# EAGLE schematic A-2 sch (EAGLE 9.6.2)
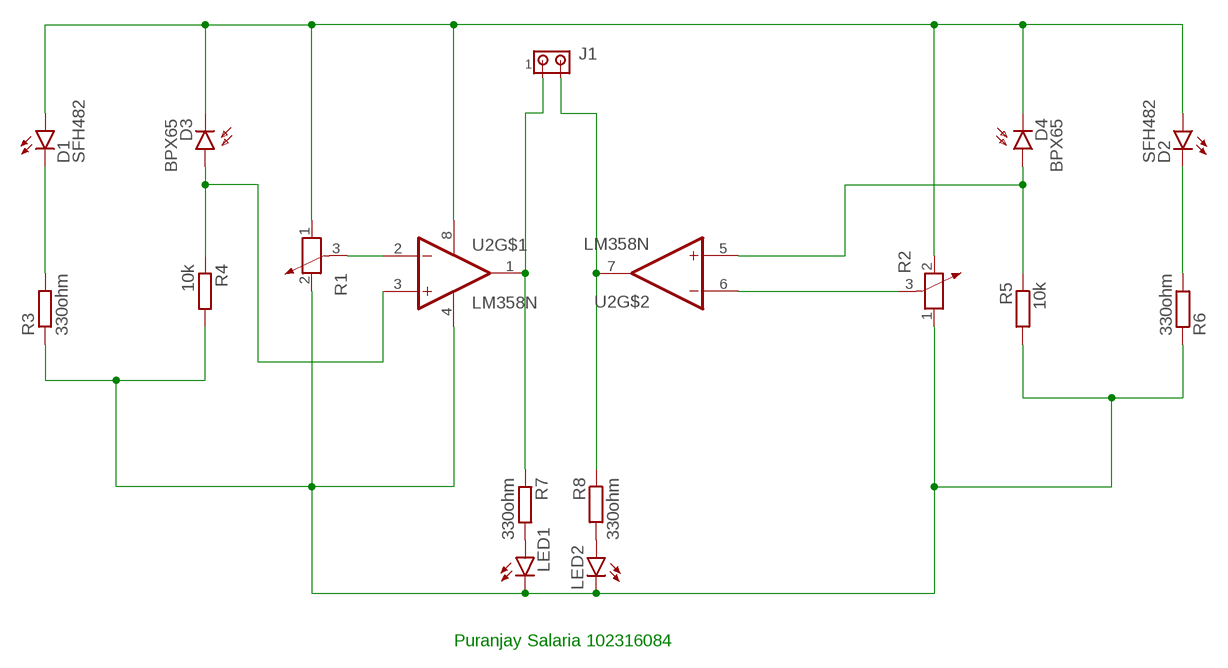
[diagram p0: schematic, sheet 1]

## Parts
D1  SFH482  [SFH482]
D2  SFH482  [SFH482]
D3  BPX65  [BPX65]
D4  BPX65  [BPX65]
J1  MTA02-100  [10X02MTA]
LED1  LED3MM  [LED3MM]
LED2  LED3MM  [LED3MM]
R1  POTENTIOMETER_PT-10  [PT-10]
R2  POTENTIOMETER_PT-10  [PT-10]
R3  330ohm  R-EU_0204/5  [0204/5]
R4  10k  R-EU_0204/5  [0204/5]
R5  10k  R-EU_0204/5  [0204/5]
R6  330ohm  R-EU_0204/5  [0204/5]
R7  330ohm  R-EU_0204/5  [0204/5]
R8  330ohm  R-EU_0204/5  [0204/5]
U2  LM358N  [DIP762W46P254L960H508Q8]

## Nets
N$1: LED1.A R7.2
N$2: D1.A D2.A D3.K(C) D4.K(C) R1.1 R2.2 U2.8(VCC)
N$3: D1.K(C) R3.2
N$4: D3.A R4.1 U2.3(1IN+)
N$5: LED1.K(C) LED2.K(C) R1.2 R2.1 R3.1 R4.2 R5.2 R6.1 U2.4(GND)
N$6: J1.1 R7.1 U2.1(1OUT)
N$7: R1.3 U2.2(1IN-)
N$8: LED2.A R8.2
N$9: J1.2 R8.1 U2.7(2OUT)
N$10: D2.K(C) R6.2
N$11: D4.A R5.1 U2.5(2IN+)
N$13: R2.3 U2.6(2IN-)

## Notes on the sheet
- Puranjay Salaria 102316084

## Library data of the parts
D1 D2 = led:SFH482: IR LED infrared emitting diode, Infineon
D3 D4 = opto-trans-siemens:BPX65: PHOTO DIODE; MPN: BPX65.; OC_FARNELL: 327451; OC_NEWARK: 06WX2764
J1 = con-amp:MTA02-100: AMP connector
LED1 LED2 = led:LED: LED OSRAM: - CHIPLED LG R971, LG N971, LY N971, LG Q971, LY Q971, LO R971, LY R971 LH N974, LH R974 LS Q976, LO Q976, LY Q976 LO Q996 - Hyper CHIPLED LW Q18S LB Q993, LB Q99A, LB R99A - SideLED LS A670, LO A670, LY A670, LG A670, LP A670 LB A673, LV A673, LT A673, LW A673 LH A674 LY A675 LS A676, LA A676, LO A676, LY A676, LW A676 LS A679, LY A679, LG A679 - Hyper Micro SIDELED® LS Y876, LA Y876, LO Y876, LY Y876 LT Y87S - SmartLED LW L88C, LW L88S LB L89C, LB L89S, LG L890 LS L89K, LO L89K, LY L89K LS L896, LA L896, LO L896, LY L896 - TOPLED LS T670, LO T670, LY T670, LG T670, LP T670 LSG T670, LSP T670, LSY T670, LOP T670, LYG T670 LG T671, LOG T671, LSG T671 LB T673, LV T673, LT T673, LW T673 LH T674 LS T676, LA T676, LO T676, LY T676, LB T676, LH T676, LSB T676, LW T676 LB T67C, LV T67C, LT T67C, LS T67K, LO T67K, LY T67K, LW E67C LS E67B, LA E67B, LO E67B, LY E67B, LB E67C, LV E67C, LT E67C LW T67C LS T679, LY T679, LG T679 LS T770, LO T770, LY T770, LG T770, LP T770 LB T773, LV T773, LT T773, LW T773 LH T774 LS E675, LA E675, LY E675, LS T675 LS T776, LA T776, LO T776, LY T776, LB T776 LHGB T686 LT T68C, LB T68C - Hyper Mini TOPLED® LB M676 - Mini TOPLED Santana® LG M470 LS M47K, LO M47K, LY M47K Source: http://www.osram.convergy.de LUXEON: - LUMILED® LXK2-PW12-R00, LXK2-PW12-S00, LXK2-PW14-U00, LXK2-PW14-V00 LXK2-PM12-R00, LXK2-PM12-S00, LXK2-PM14-U00 LXK2-PE12-Q00, LXK2-PE12-R00, LXK2-PE12-S00, LXK2-PE14-T00, LXK2-PE14-U00 LXK2-PB12-K00, LXK2-PB12-L00, LXK2-PB12-M00, LXK2-PB14-N00, LXK2-PB14-P00, LXK2-PB14-Q00 LXK2-PR12-L00, LXK2-PR12-M00, LXK2-PR14-Q00, LXK2-PR14-R00 LXK2-PD12-Q00, LXK2-PD12-R00, LXK2-PD12-S00 LXK2-PH12-R00, LXK2-PH12-S00 LXK2-PL12-P00, LXK2-PL12-Q00, LXK2-PL12-R00 Source: www.luxeon.com KINGBRIGHT: KA-3528ASYC Source: www.kingbright.com
R1 R2 = rcl:POTENTIOMETER_: Potentiometer; SPICEMODEL: POT; SPICEPREFIX: X
R3-R8 = rcl:R-EU_: RESISTOR, European symbol; SPICEPREFIX: R
U2 = LM358N:LM358N: IC OPAMP GP 2 CIRCUIT 8DIP Check availability <https://pricing.snapeda.com/parts/LM358N/Harris%20Corporation/view-part?ref=eda>; AVAILABILITY: Not in stock; CHECK_PRICES: https://www.snapeda.com/parts/LM358N/Harris/view-part/?ref=eda; DESCRIPTION: General Purpose Amplifier 2 Circuit 8-PDIP; MF: Harris Corporation; MP: LM358N; PACKAGE: None; PRICE: None; SNAPEDA_LINK: https://www.snapeda.com/parts/LM358N/Harris/view-part/?ref=snap